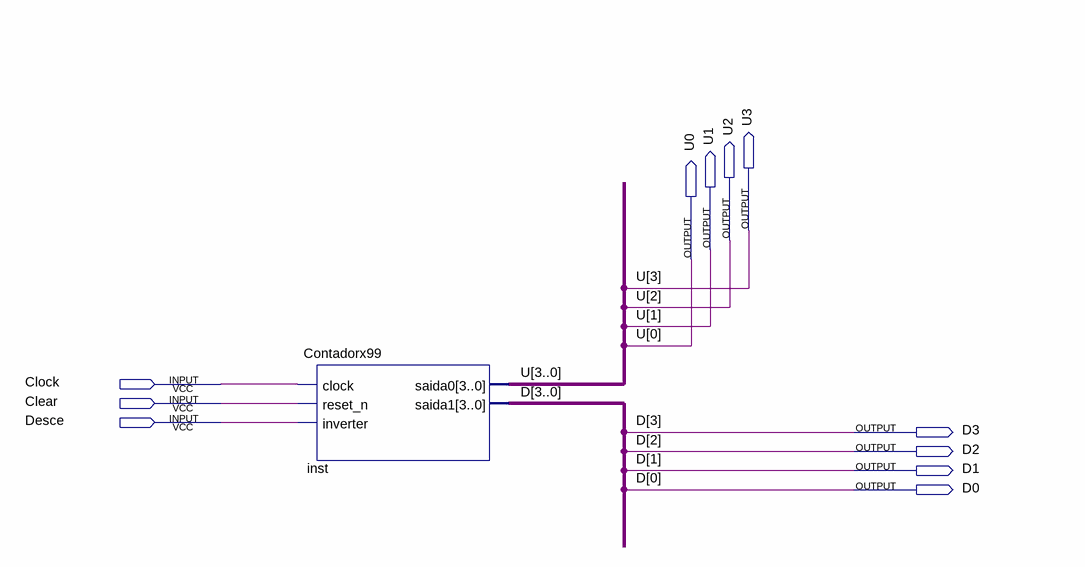
[diagram p0: schematic sheet]
// Quartus schematic Pontos.bdf as structural Verilog: 1 symbols, 11 pins
module Pontos (
  input  Clock,
  input  Clear,
  input  Desce,
  output U3,
  output U2,
  output U1,
  output U0,
  output D3,
  output D2,
  output D1,
  output D0
);

  Contadorx99 inst (
    .clock(Clock), .reset_n(Clear), .inverter(Desce), .saida0({U3, U2, U1, U0}), .saida1({D3, D2, D1, D0}));
endmodule
